# EasyEDA Pro project ProProject_ESP32-NOBREAK_2024-08-03.epro

# Schematic ESP32-NOBREAK
Create Date: 2024-07-30; Page Name: P1; Project Name: ESP32-NOBREAK; Schematic Name: ESP32-NOBREAK; Update Date: 2024-08-01
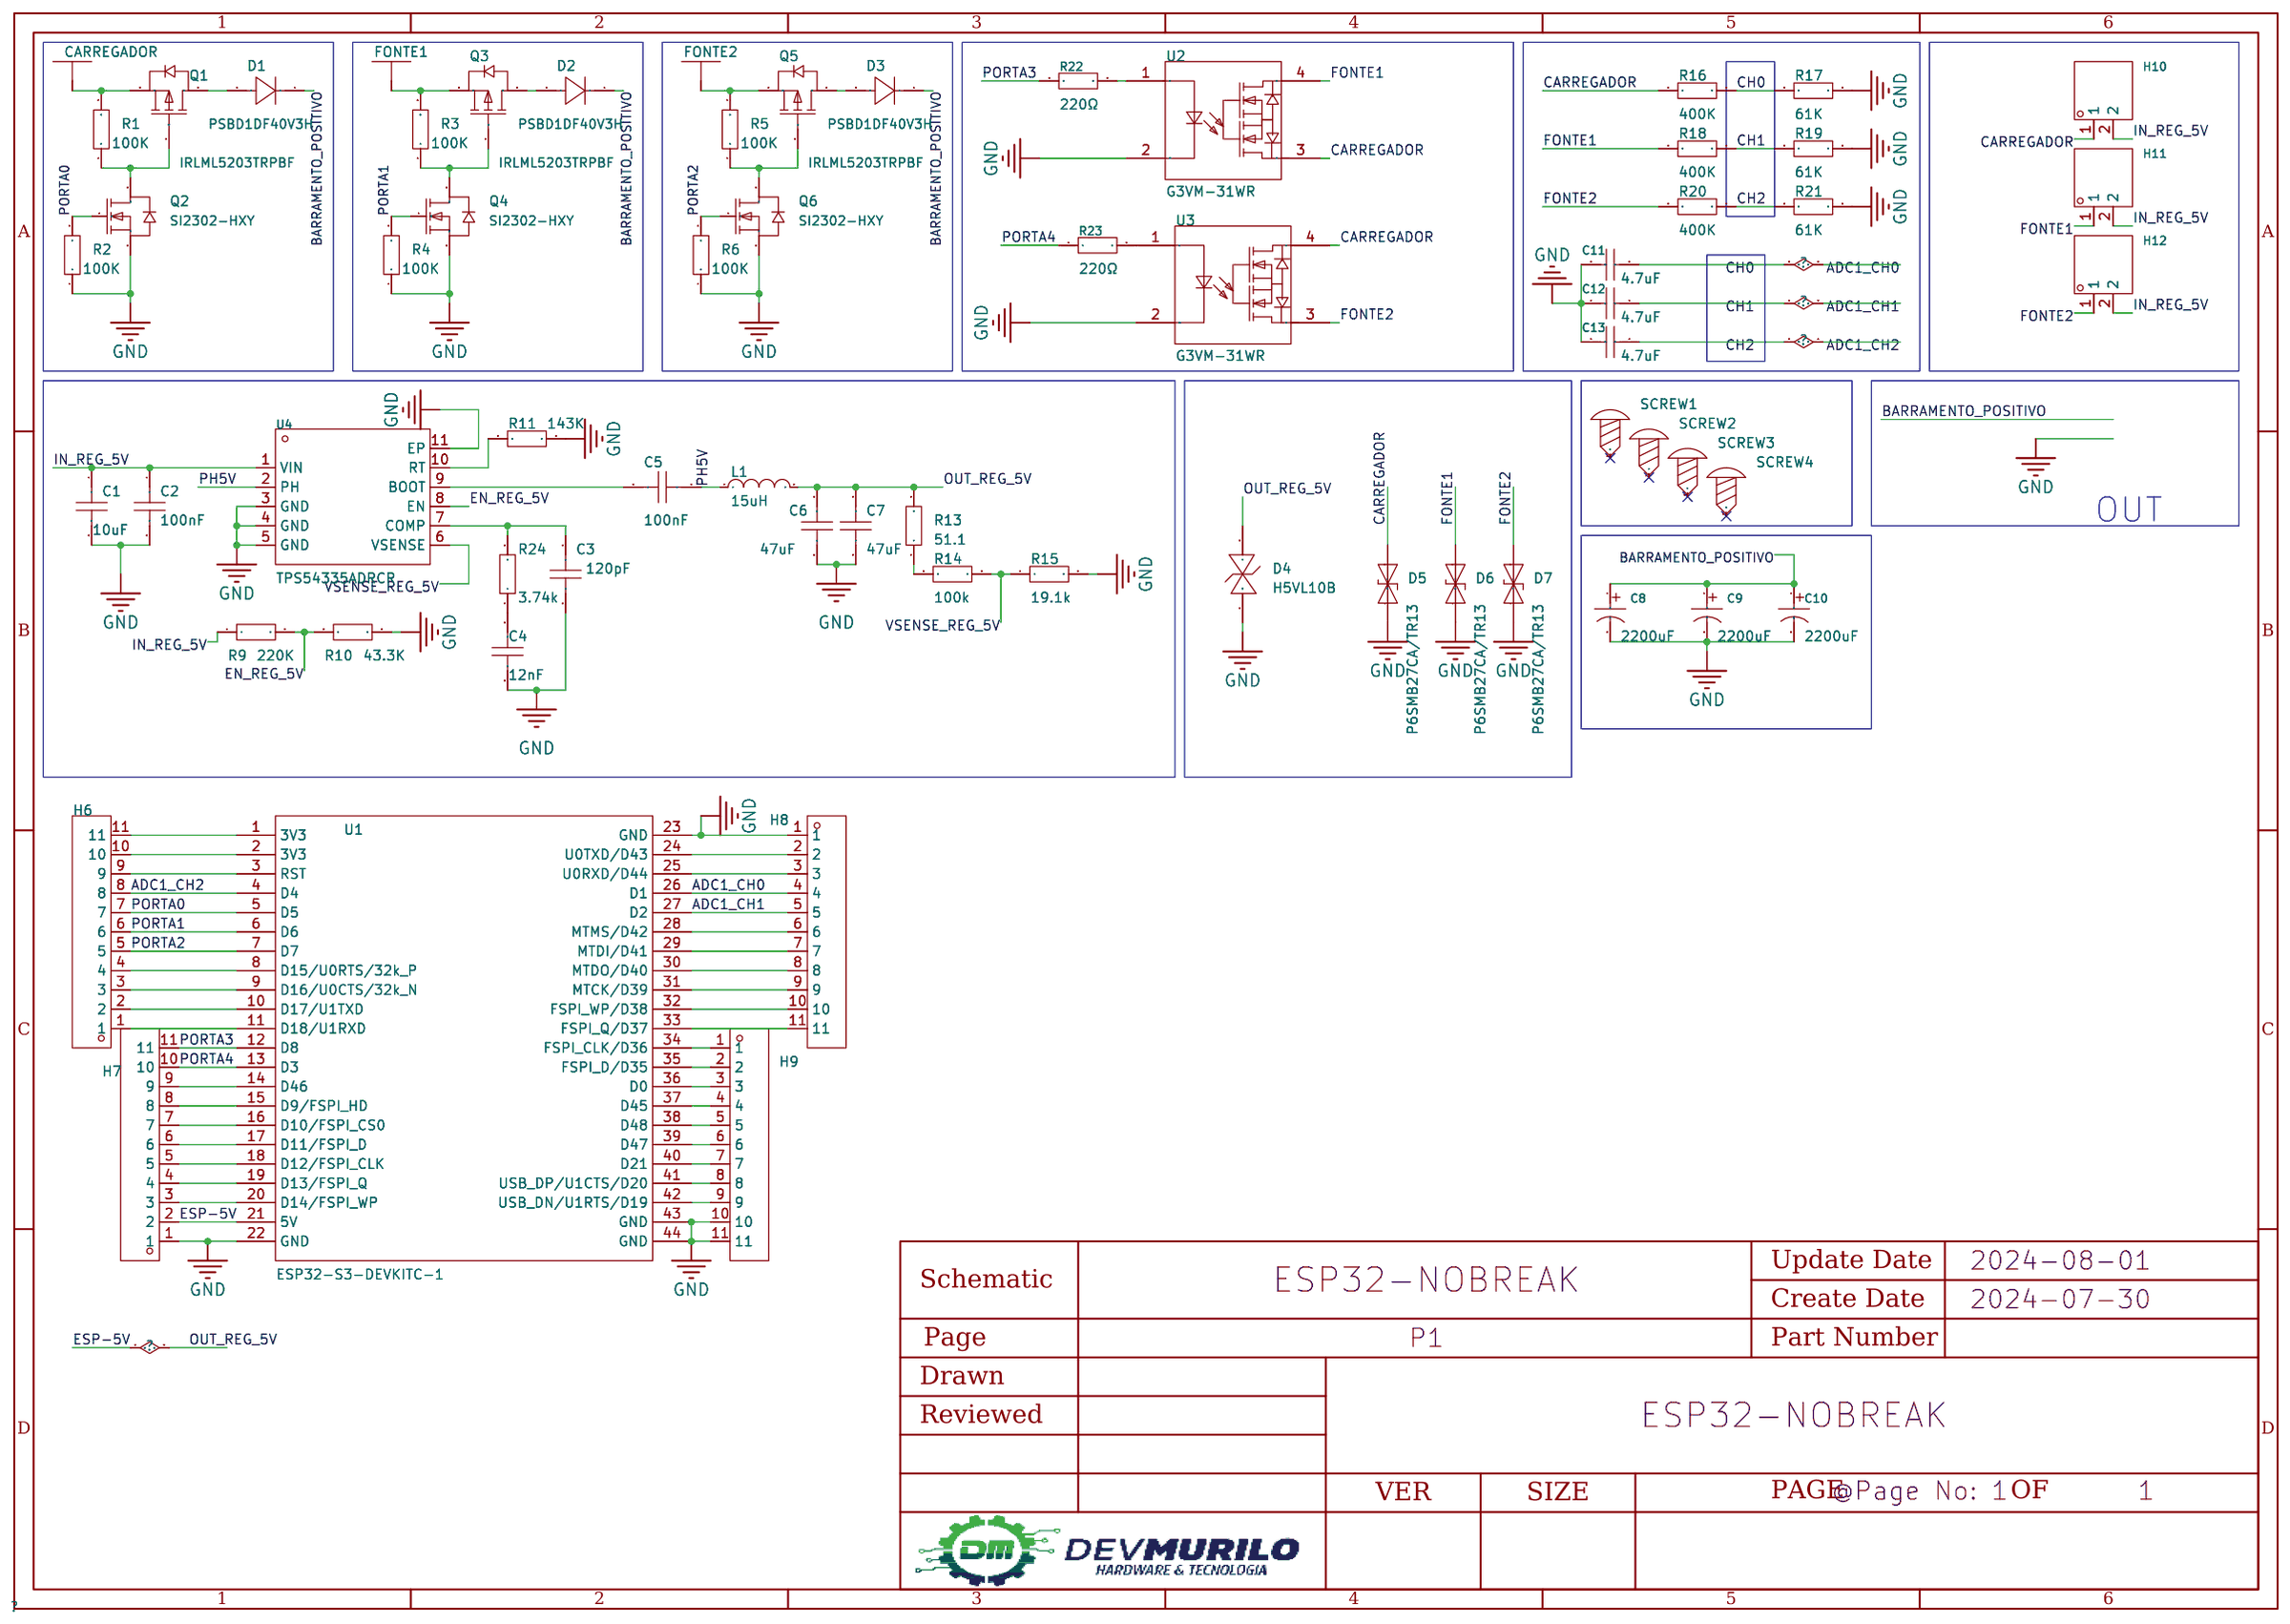
[diagram p0: schematic sheet]

## Parts
C1  10uF  [C0603]
C2  100nF  [C0603]
C3  120pF  [C0603]
C4  12nF  [C0603]
C5  100nF  [C0603]
C6  47uF  [C0603]
C7  47uF  [C0603]
C8  2200uF  [CAP-TH_BD13.0-P5.00-D0.6-FD]
C9  2200uF  [CAP-TH_BD13.0-P5.00-D0.6-FD]
C10  2200uF  [CAP-TH_BD13.0-P5.00-D0.6-FD]
C11  4.7uF  [C0603]
C12  4.7uF  [C0603]
C13  4.7uF  [C0603]
D1  PSBD1DF40V3H  [SOD-123FL_L2.8-W1.8-LS3.7-RD]
D2  PSBD1DF40V3H  [SOD-123FL_L2.8-W1.8-LS3.7-RD]
D3  PSBD1DF40V3H  [SOD-123FL_L2.8-W1.8-LS3.7-RD]
D4  H5VL10B  [SOD-882_L1.0-W0.6-BI]
D5  P6SMB27CA/TR13  [SMB_L4.3-W3.6-LS5.4-BI]
D6  P6SMB27CA/TR13  [SMB_L4.3-W3.6-LS5.4-BI]
D7  P6SMB27CA/TR13  [SMB_L4.3-W3.6-LS5.4-BI]
H6  -  [HDR-TH_11P-P2.54-V-M]
H7  -  [HDR-TH_11P-P2.54-V-M]
H8  -  [HDR-TH_11P-P2.54-V-M]
H9  -  [HDR-TH_11P-P2.54-V-M]
H10  -  [HDR-TH_2P-P2.54-V-M-1]
H11  -  [HDR-TH_2P-P2.54-V-M-1]
H12  -  [HDR-TH_2P-P2.54-V-M-1]
L1  15uH  [IND-SMD_L7.5-W6.6]
Q1  IRLML5203TRPBF  [SOT-23-3_L2.9-W1.3-P1.90-LS2.4-BR]
Q2  SI2302-HXY  [SOT-23-3_L2.9-W1.3-P1.90-LS2.4-BR]
Q3  IRLML5203TRPBF  [SOT-23-3_L2.9-W1.3-P1.90-LS2.4-BR]
Q4  SI2302-HXY  [SOT-23-3_L2.9-W1.3-P1.90-LS2.4-BR]
Q5  IRLML5203TRPBF  [SOT-23-3_L2.9-W1.3-P1.90-LS2.4-BR]
Q6  SI2302-HXY  [SOT-23-3_L2.9-W1.3-P1.90-LS2.4-BR]
R1  100K  [R0603]
R2  100K  [R0603]
R3  100K  [R0603]
R4  100K  [R0603]
R5  100K  [R0603]
R6  100K  [R0603]
R9  220K  [R0603]
R10  43.3K  [R0603]
R11  143K  [R0603]
R13  51.1  [R0603]
R14  100k  [R0603]
R15  19.1k  [R0603]
R16  400K  [R0603]
R17  61K  [R0603]
R18  400K  [R0603]
R19  61K  [R0603]
R20  400K  [R0603]
R21  61K  [R0603]
R22  220Ω  [R0603]
R23  220Ω  [R0603]
R24  3.74k  [R0603]
SCREW1  -  [Screw-Hole-M3]
SCREW2  -  [Screw-Hole-M3]
SCREW3  -  [Screw-Hole-M3]
SCREW4  -  [Screw-Hole-M3]
U1  ESP32-S3-DEVKITC-1  [ESP32-S3-DEVKITC-1]
U2  G3VM-31WR  [OPTO-SMD_OMRON_G3VM-31WR]
U3  G3VM-31WR  [OPTO-SMD_OMRON_G3VM-31WR]
U4  TPS54335ADRCR  [VSON-10_L3.0-W3.0-P0.50-TL-EP]

## Library data of the parts
C1-C7 = CAP_0603: Supplier Footprint: 0603
C8-C10 = GR228M035J25RR0VH4FP0: Capacitance:2200uF Tolerance:±20% Tolerance:±20% Rated Voltage: Ripple Current:- Equivalent Series Resistance(ESR):- Lead Spacing: φD: L: Lifetime @ Temp:- Operating Temperature:-40℃~+105℃ Operating Temperature:-40℃~+105℃; LCSC Part Name: 2200uF ±20% 35V; Supplier Part: C43275; Manufacturer: CX(承兴); Supplier Footprint: 插件,D13xL25mm; JLCPCB Part Class: Extended Part; Datasheet: https://atta.szlcsc.com/upload/public/pdf/source/20211027/ED0DA65C69F42D9BDEC91091BA4C03CD.pdf; Supplier: LCSC; Tolerance: ±20%; Operating Temperature: -40℃~+105℃
C11-C13 = CL10A475KP8NNNC: Capacitance: Tolerance:±10% Tolerance:±10% Voltage Rated: Temperature Coefficient:; LCSC Part Name: 4.7uF ±10% 10V; Supplier Part: C1705; Manufacturer: SAMSUNG(三星); Supplier Footprint: 0603; JLCPCB Part Class: Extended Part; Datasheet: https://atta.szlcsc.com/upload/public/pdf/source/20160218/1457707763339.pdf; Supplier: LCSC; Tolerance: ±10%
D1-D3 = PSBD1DF40V3H: Diode Configuration: Forward Voltage (Vf@If):550mV@1A Reverse Voltage (Vr): Average Rectified Current (Io): Power Dissipation:- Reverse Leakage Current:500uA@40V Reverse Recovery Time (trr):- Operating Temperature:-55℃~+150℃@(Tj) Operating Temperature:-55; LCSC Part Name: 电压:40V 电流:3A; Supplier Part: C918826; Manufacturer: Prisemi(芯导); Supplier Footprint: SOD-123FL; JLCPCB Part Class: Extended Part; Datasheet: https://atta.szlcsc.com/upload/public/pdf/source/20200316/C496545_D1644566B4C68CC5A9F3C2B76CEE5624.pdf; Supplier: LCSC; Forward Voltage (Vf@If): 550mV@1A; Reverse Leakage Current: 500uA@40V; Operating Temperature: -55℃~+150℃@(Tj)
D4 = H5VL10B: polarity:Bi-Directional Reverse Stand-Off Voltage (Vrwm):5V Maximum Clamping Voltage:10V Peak Pulse Current (Ipp)@10/1000us:5A Peak Pulse Power Dissipation (Ppp)@10/1000us:50W Breakdown Voltage:5.6V Reverse Leakage Current (Ir):100nA Number of Lines:单路 Op; Supplier Part: C7420372; Manufacturer: 宏迦橙; Supplier Footprint: DFN1006-2L; Datasheet: https://atta.szlcsc.com/upload/public/pdf/source/20230630/5024ECFEAD3C9801B07A8DBB967AB462.pdf; Supplier: LCSC; polarity: Bi-Directional; Reverse Stand-Off Voltage (Vrwm): 5V; Maximum Clamping Voltage: 10V; Peak Pulse Current (Ipp)@10/1000us: 5A; Peak Pulse Power Dissipation (Ppp)@10/1000us: 50W; Breakdown Voltage: 5.6V; Reverse Leakage Current (Ir): 100nA; Number of Lines: 单路; Operating Temperature: -55℃~+155℃; Type: TVS
D5-D7 = P6SMB27CA/TR13: polarity:Bi-Directional Reverse Stand-Off Voltage (Vrwm):23.1V Maximum Clamping Voltage:37.5V Peak Pulse Current (Ipp)@10/1000us:16.3A Peak Pulse Power Dissipation (Ppp)@10/1000us:600W Breakdown Voltage:25.7V Reverse Leakage Current (Ir):1uA Type:TVS; Supplier Part: C730015; Manufacturer: Brightking(君耀电子); Supplier Footprint: SMB(DO-214AA); Datasheet: https://atta.szlcsc.com/upload/public/pdf/source/20200427/C523079_59166269390C2E39D506F571DF3F73BD.pdf; Supplier: LCSC; polarity: Bi-Directional; Reverse Stand-Off Voltage (Vrwm): 23.1V; Maximum Clamping Voltage: 37.5V; Peak Pulse Current (Ipp)@10/1000us: 16.3A; Peak Pulse Power Dissipation (Ppp)@10/1000us: 600W; Breakdown Voltage: 25.7V; Reverse Leakage Current (Ir): 1uA; Type: TVS
H6-H9 = HDR-M_2.54_1x11P: Supplier Footprint: Through
H10-H12 = HDR-M_2.54_1x2P: Supplier Footprint: Through
L1 = CKST0605-15uH/M: Inductance: Tolerance:±20% Tolerance:±20% Rated Current: Saturation Current (Isat):4A DC Resistance (DCR):- Type:- Ratings:-; LCSC Part Name: 15uH ±20% 4A; Supplier Part: C3002651; Manufacturer: CENKER(岑科); Supplier Footprint: SMD,6.6x7.5mm; JLCPCB Part Class: Extended Part; Datasheet: https://atta.szlcsc.com/upload/public/pdf/source/20220713/D31DF092F41B22BC51FAADD502977C44.pdf; Supplier: LCSC; Tolerance: ±20%; Saturation Current (Isat): 4A
Q1 Q3 Q5 = IRLML5203TRPBF: Type:1个PChannel Drain Source Voltage (Vdss): Continuous Drain Current (Id): Power Dissipation (Pd): Drain Source On Resistance (RDS(on)@Vgs,Id):98mΩ@10V,3A Gate Threshold Voltage (Vgs(th)@Id):2.5V@250uA Total Gate Charge (Qg@Vgs):14nC@10V Input Capacitanc; LCSC Part Name: 1个P沟道 耐压:30V 电流:3A; Supplier Part: C2592; Manufacturer: Infineon(英飞凌); Supplier Footprint: SOT-23; JLCPCB Part Class: Extended Part; Datasheet: https://atta.szlcsc.com/upload/public/pdf/source/20200421/C513150_A0DAD0CB9056D25908B6C1BFCDF98824.pdf; Supplier: LCSC; Type: 1个PChannel; Drain Source On Resistance (RDS(on)@Vgs,Id): 98mΩ@10V,3A; Gate Threshold Voltage (Vgs(th)@Id): 2.5V@250uA; Total Gate Charge (Qg@Vgs): 14nC@10V; Input Capacitance (Ciss@Vds): 510pF@25V; Operating Temperature: -55℃~+150℃@(Tj)
Q2 Q4 Q6 = SI2302-HXY: Type:1个NChannel Drain Source Voltage (Vdss): Continuous Drain Current (Id): Power Dissipation (Pd):900mW Drain Source On Resistance (RDS(on)@Vgs,Id):55mΩ@4.5V,2.8A Gate Threshold Voltage (Vgs(th)@Id):1.2V@250uA Input Capacitance (Ciss@Vds):260pF@10V; LCSC Part Name: 1个N沟道 耐压:20V 电流:2.8A; Supplier Part: C4748714; Manufacturer: HXY MOSFET(华轩阳电子); Supplier Footprint: SOT-23; JLCPCB Part Class: Extended Part; Datasheet: https://atta.szlcsc.com/upload/public/pdf/source/20220720/B2EC63D46AD65363D9D3692163B46869.pdf; Supplier: LCSC; Type: 1个NChannel; Power Dissipation (Pd): 900mW; Drain Source On Resistance (RDS(on)@Vgs,Id): 55mΩ@4.5V,2.8A; Gate Threshold Voltage (Vgs(th)@Id): 1.2V@250uA; Input Capacitance (Ciss@Vds): 260pF@10V
R1-R6 R11 R13-R21 R24 = Res_0603: Supplier Footprint: 0603
R9 R10 = Res_0201: Supplier Footprint: 0201
R22 R23 = 0603WAF2200T5E: Type:Thick Film Resistors Resistance: Tolerance:±1% Tolerance:±1% Power(Watts): Overload Voltage (Max): Temperature Coefficient:±100ppm/℃ Temperature Coefficient:±100ppm/℃ Operating Temperature Range:-55℃~+155℃ Operating Temperature Range:-55℃~+155℃; LCSC Part Name: 220Ω ±1% 100mW 厚膜电阻; Supplier Part: C22962; Manufacturer: UNI-ROYAL(厚声); Supplier Footprint: 0603; JLCPCB Part Class: Basic Part; Datasheet: https://atta.szlcsc.com/upload/public/pdf/source/20200306/C422600_1E6D84923E4A46A82E41ADD87F860B5C.pdf; Supplier: LCSC; Type: Thick Film Resistors; Tolerance: ±1%; Temperature Coefficient: ±100ppm/℃; Operating Temperature Range: -55℃~+155℃
SCREW1-SCREW4 = Screw-Hole-M3: Supplier Footprint: 插件
U1 = ESP32-S3-DEVKITC-1: Manufacturer: Espressif; Manufacturer Part: ESP32-S3-DEVKITC-1U-N8R8; Supplier: DigiKey; Supplier Part: 1965-ESP32-S3-DEVKITC-1U-N8R8-ND; _: 3; Price: 99,23DKr
U2 U3 = G3VM-31WR: Supplier Part: C9900059545; Supplier Footprint: P-SON4; Supplier: LCSC
U4 = TPS54335ADRCR: Function:Step-down type Output Type:Adjustable Input Voltage:4.5V~28V Input Voltage:4.5V~28V Output Voltage:800mV~24V Output Voltage:800mV~24V Output Current (Max):3A Switching Frequency:1.5MHz Operating Temperature:-40℃~+150℃@(TJ) Operating Temperature:-; Supplier Part: C473400; Manufacturer: TI(德州仪器); Supplier Footprint: VSON-10-EP(3x3); JLCPCB Part Class: Extended Part; Datasheet: https://www.ti.com/cn/lit/gpn/tps54335a; Supplier: LCSC; Function: Step-down type; Output Type: Adjustable; Input Voltage: 4.5V~28V; Output Voltage: 800mV~24V; Output Current (Max): 3A; Switching Frequency: 1.5MHz; Operating Temperature: -40℃~+150℃@(TJ); Synchronous Rectification: Yes; Number of Outputs: 1; Topology: Step-down; Switch tube (built-in/external): 内置

## Nets
GND: C1.2 C2.2 C3.2 C4.2 C6.2 C7.2 C8.2 C9.2 C10.2 C11.1 C12.1 C13.1 D4.1(C) D5.1 D6.1 D7.1 H7.1 H8.1 H9.10 H9.11 Q2.2(S) Q4.2(S) Q6.2(S) R2.1 R4.1 R6.1 R10.2 R11.2 R15.2 R17.2 R19.2 R21.2 U1.22(GND) U1.23(GND) U1.43(GND) U1.44(GND) U2.2 U3.2 U4.3(GND) U4.4(GND) U4.5(GND) U4.11(EP)
ADC1_CH0: C11.2 H8.4 R16.2 R17.1 U1.26(D1)
ADC1_CH1: C12.2 H8.5 R18.2 R19.1 U1.27(D2)
ADC1_CH2: C13.2 H6.8 R20.2 R21.1 U1.4(D4)
BARRAMENTO_POSITIVO: C8.1 C9.1 C10.1 D1.1(K) D2.1(K) D3.1(K)
CARREGADOR: D5.2 H10.1 Q1.2(S) R1.2 R16.1 U2.3 U3.4
EN_REG_5V: R9.2 R10.1 U4.8(EN)
ESP-5V: C6.1 C7.1 D4.2(A) H7.2 L1.2 R13.2 U1.21(5V)
FONTE1: D6.2 H11.1 Q3.2(S) R3.2 R18.1 U2.4
FONTE2: D7.2 H12.1 Q5.2(S) R5.2 R20.1 U3.3
IN_REG_5V: C1.1 C2.1 H10.2 H11.2 H12.2 R9.1 U4.1(VIN)
PH5V: C5.1 L1.1 U4.2(PH)
PORTA0: H6.7 Q2.1(G) R2.2 U1.5(D5)
PORTA1: H6.6 Q4.1(G) R4.2 U1.6(D6)
PORTA2: H6.5 Q6.1(G) R6.2 U1.7(D7)
PORTA3: H7.11 R22.1 U1.12(D8)
PORTA4: H7.10 R23.1 U1.13(D3)
VSENSE_REG_5V: R14.2 R15.1 U4.6(VSENSE)
$1N629: D1.2(A) Q1.3(D)
$1N643: Q1.1(G) Q2.3(D) R1.1
$1N952: D2.2(A) Q3.3(D)
$1N954: Q3.1(G) Q4.3(D) R3.1
$1N1160: D3.2(A) Q5.3(D)
$1N1162: Q5.1(G) Q6.3(D) R5.1
$1N1257: R22.2 U2.1
$1N1849: R11.1 U4.10(RT)
$1N1919: C5.2 U4.9(BOOT)
$1N2046: C3.1 R24.2 U4.7(COMP)
$1N2413: R13.1 R14.1
$1N6328: R23.2 U3.1
$1N9020: H6.11 U1.1(3V3)
$1N9023: H6.10 U1.2(3V3)
$1N9026: H6.9 U1.3(RST)
$1N9087: H6.4 U1.8(D15/U0RTS/32k_P)
$1N9090: H6.3 U1.9(D16/U0CTS/32k_N)
$1N9093: H6.2 U1.10(D17/U1TXD)
$1N9096: H6.1 U1.11(D18/U1RXD)
$1N9099: H7.9 U1.14(D46)
$1N9102: H7.8 U1.15(D9/FSPI_HD)
$1N9105: H7.7 U1.16(D10/FSPI_CS0)
$1N9108: H7.6 U1.17(D11/FSPI_D)
$1N9111: H7.5 U1.18(D12/FSPI_CLK)
$1N9114: H7.4 U1.19(D13/FSPI_Q)
$1N9117: H7.3 U1.20(D14/FSPI_WP)
$1N9288: H8.2 U1.24(U0TXD/D43)
$1N9291: H8.3 U1.25(U0RXD/D44)
$1N9294: H8.6 U1.28(MTMS/D42)
$1N9307: H8.7 U1.29(MTDI/D41)
$1N9310: H8.8 U1.30(MTDO/D40)
$1N9313: H8.9 U1.31(MTCK/D39)
$1N9316: H8.10 U1.32(FSPI_WP/D38)
$1N9319: H8.11 U1.33(FSPI_Q/D37)
$1N9322: H9.1 U1.34(FSPI_CLK/D36)
$1N9325: H9.2 U1.35(FSPI_D/D35)
$1N9328: H9.3 U1.36(D0)
$1N9331: H9.4 U1.37(D45)
$1N9334: H9.5 U1.38(D48)
$1N9337: H9.6 U1.39(D47)
$1N9340: H9.7 U1.40(D21)
$1N9343: H9.8 U1.41(USB_DP/U1CTS/D20)
$1N9346: H9.9 U1.42(USB_DN/U1RTS/D19)
$1N9442: C4.1 R24.1

Not connected (* = marked no-connect by the designer): SCREW1 1*; SCREW2 1*; SCREW3 1*; SCREW4 1*

## Notes on the sheet
- OUT

# Board PCB1
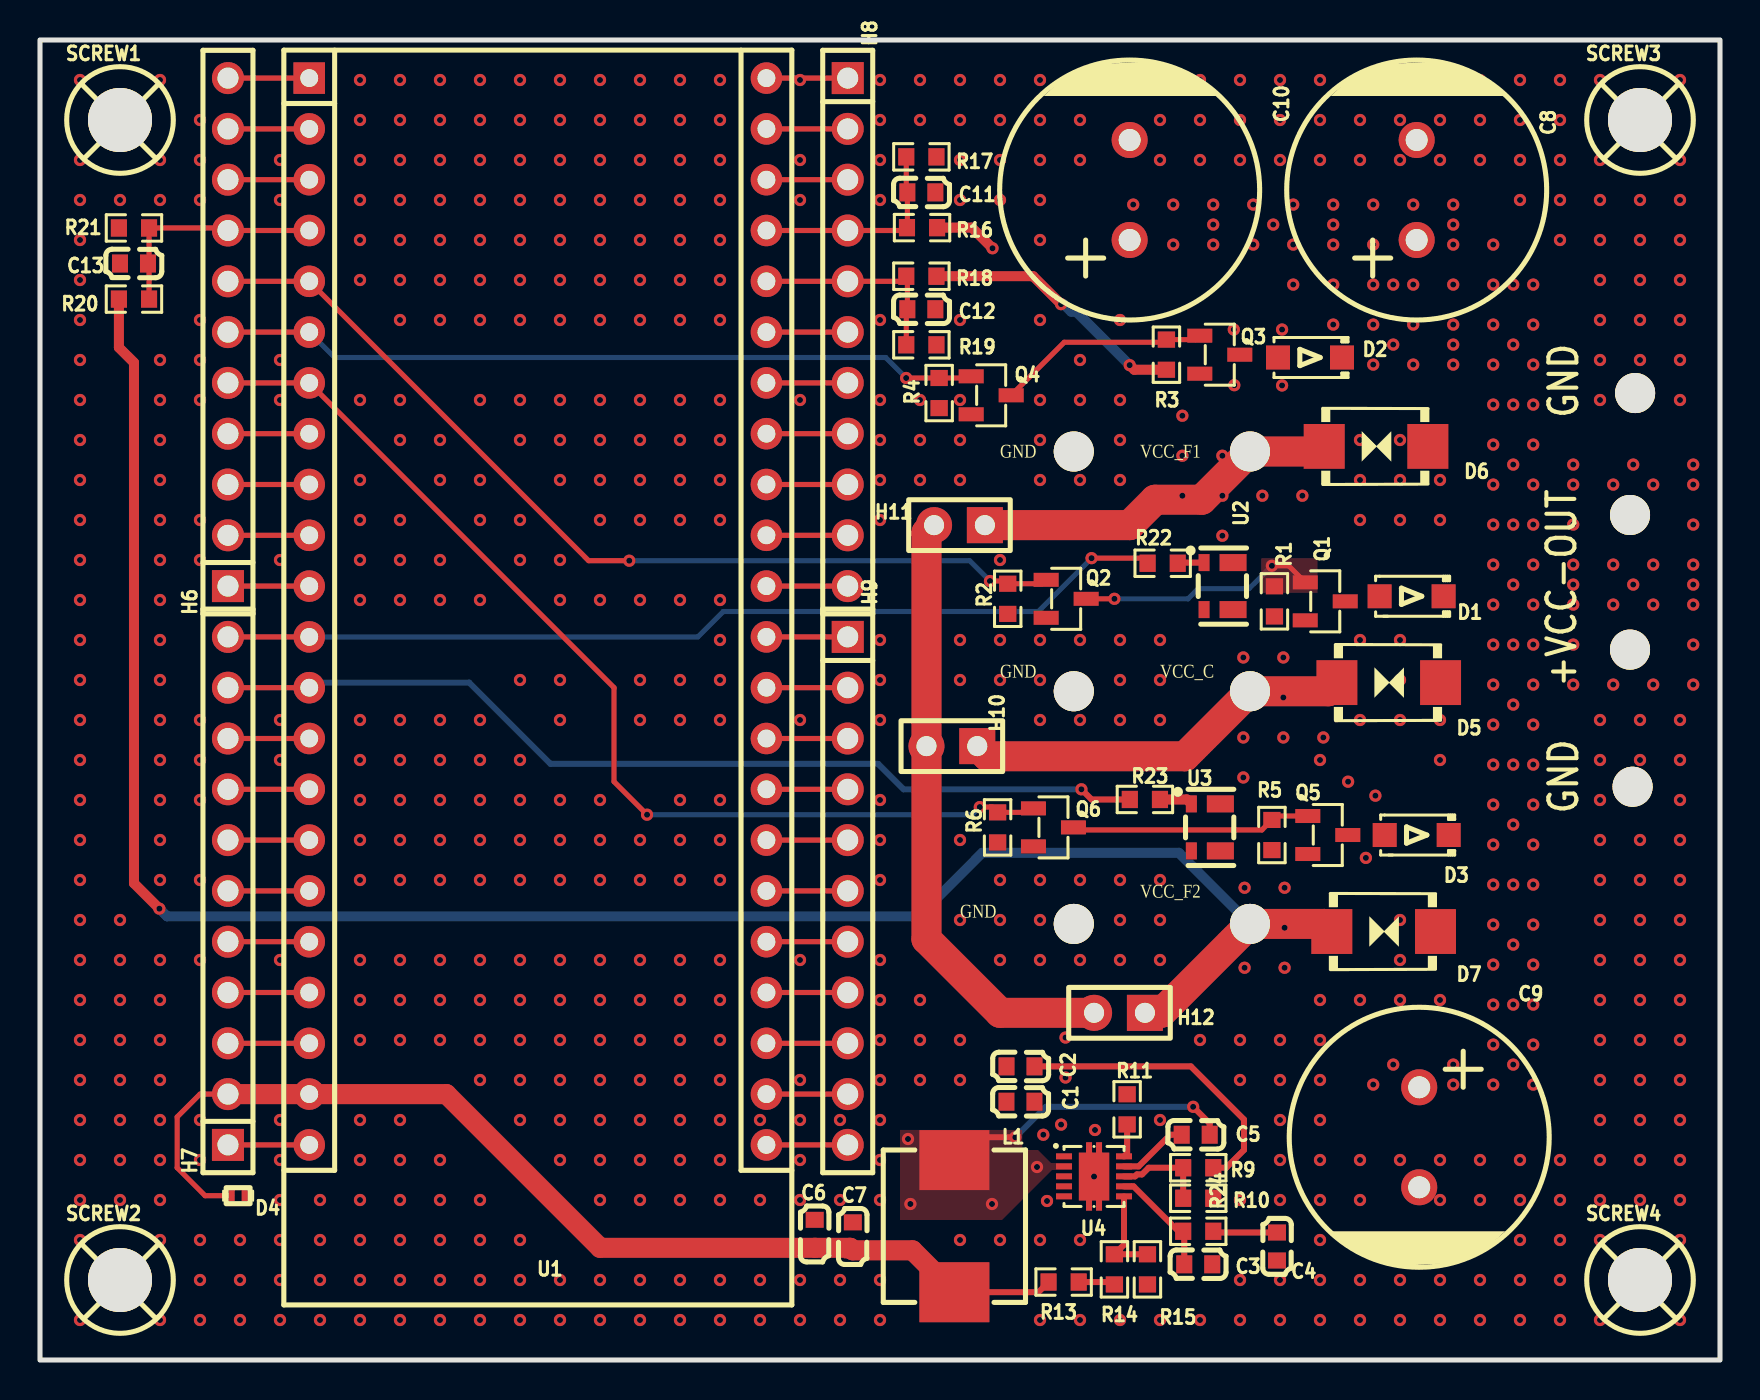
[diagram p1: board, top side]
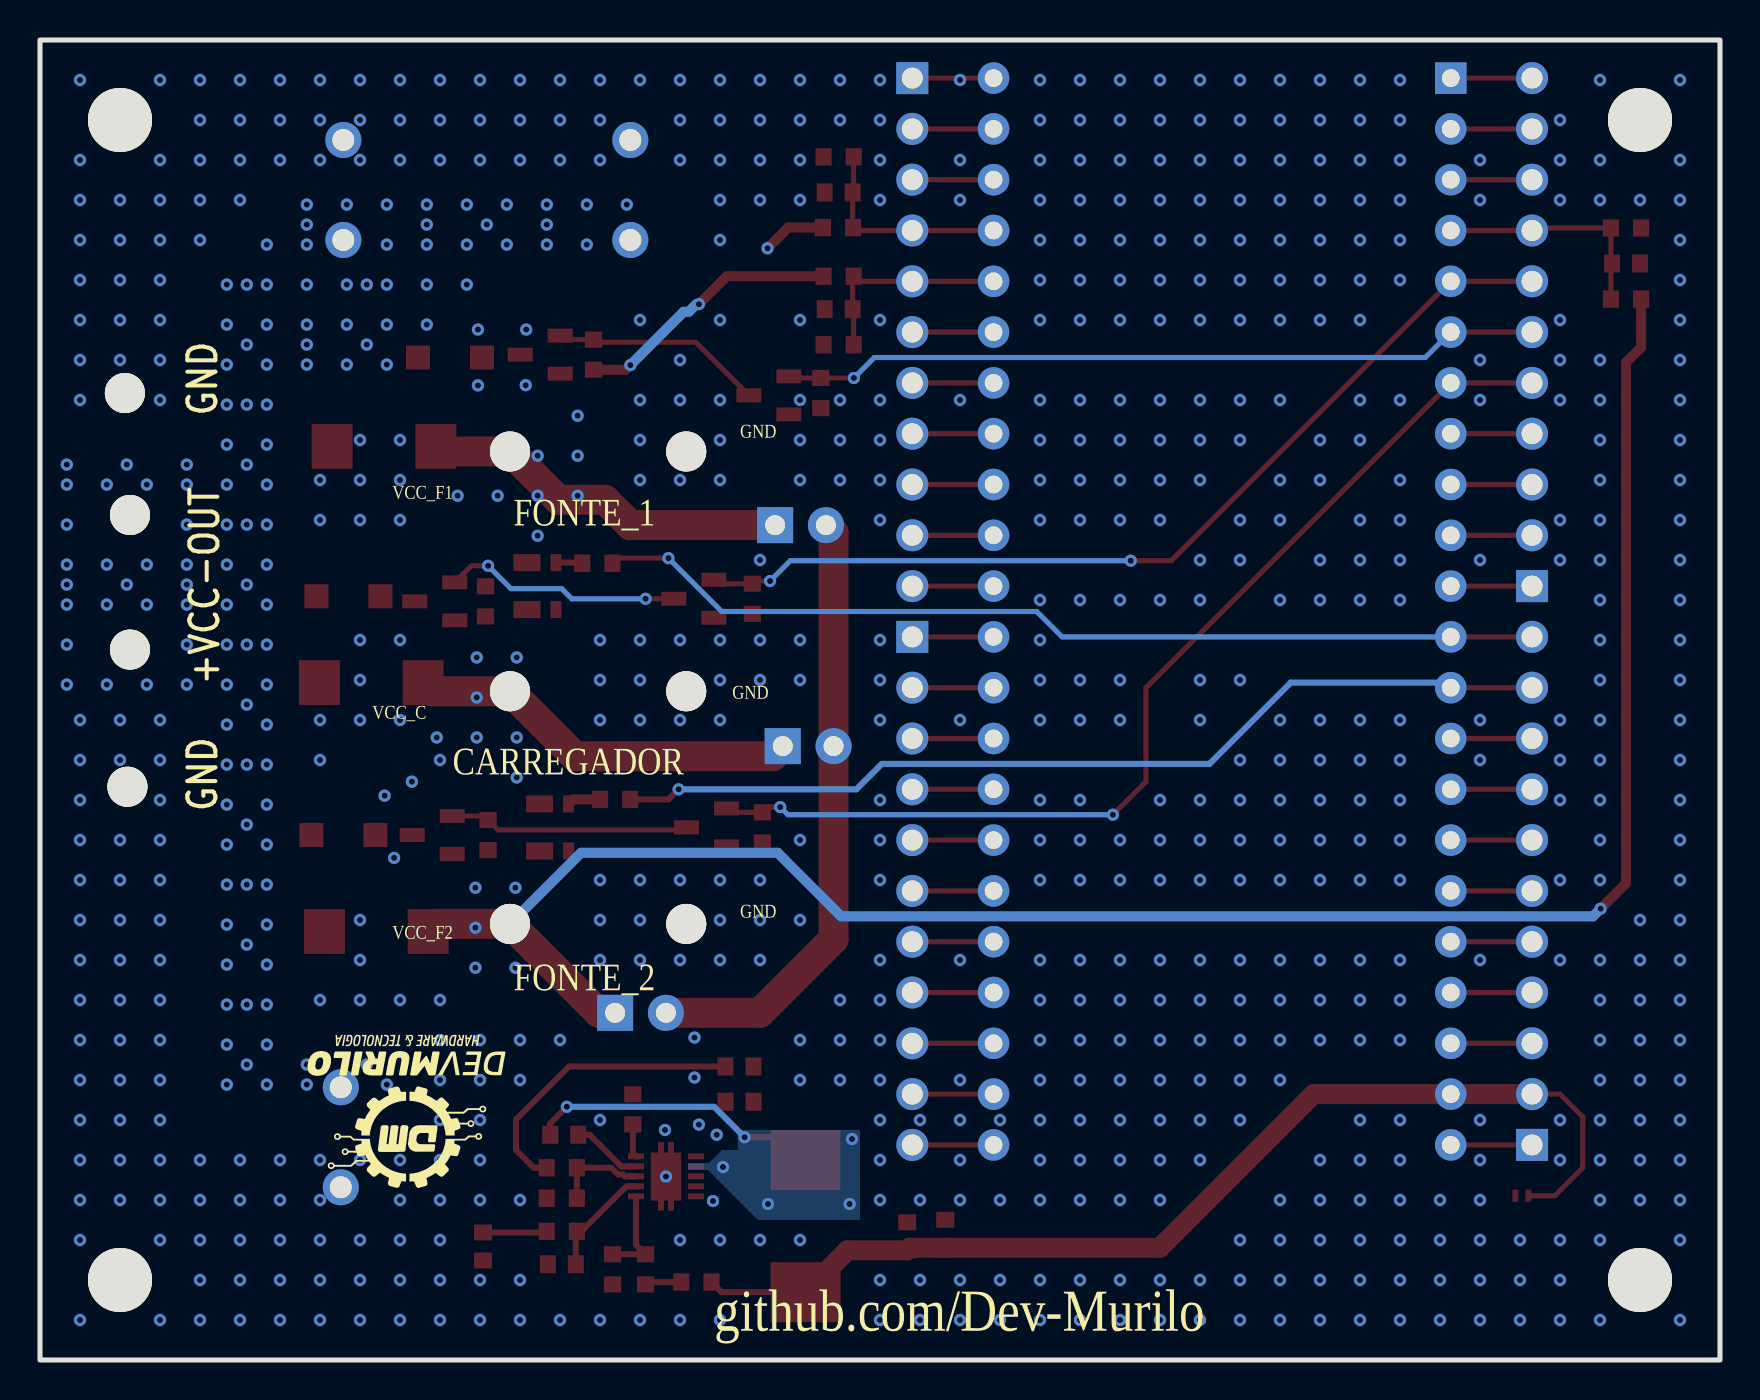
[diagram p2: board, bottom side, seen from below]

Outline 84 x 66 mm; copper layers: Top Layer, Inner1, Inner2, Bottom Layer. Coordinates in mm from the lower left corner of the outline.
Outline path: rectangle 0,66 84,0
Stack: Top Layer 0.035mm 外层铜厚1oz / Dielectric1 0.2104mm 7628 RC49% 8.6mil / Inner1 0.0152mm 内层铜厚 / Dielectric2 1.065mm 1.1mm H/HOZ 含铜 / Inner2 0.0152mm 内层铜厚 / Dielectric3 0.2104mm 7628 RC49% 8.6mil / Bottom Layer 0.035mm 外层铜厚1oz

## Design rules (mm)
template: Custom Config
spacing copperThickness1oz (default): track to track 0.102, other pairs 0.152 to 0.3
spacing copperThickness2oz: track to track 0.203, other pairs 0.152 to 0.3
spacing copperThicknessInner0.5oz: track to track 0.089, other pairs 0.152 to 0.3
track width copperThickness1oz (default): min 0.102, default 0.254, max 2.54
track width copperThickness2oz: min 0.203, default 0.254, max 2.54
track width copperThickness0.5oz: min 0.089, default 0.254, max 2.54
differential pair differentialPair (default): width min 0.127, default 0.254, max 2.54; gap min 0.152, default 0.152
via viaSize (default): diameter min 0.3, default 0.61, max 10; hole min 0.2, default 0.305, max 6.3
net  uses cooperSolidRegion
net GND uses cooperSolidRegion
net CARREGADOR uses cooperSolidRegion
net $1N629 uses cooperSolidRegion
net FONTE1 uses cooperSolidRegion
net FONTE2 uses cooperSolidRegion
net $1N1160 uses cooperSolidRegion
net IN_REG_5V uses cooperSolidRegion
net PH5V uses cooperSolidRegion
pour e474 uses cooperSolidRegion

## Placement (name value [footprint] x y rotation side)
C1  10uF  [C0603]  49.02 12.91 180 top
C2  100nF  [C0603]  49.03 14.68 180 top
C3  120pF  [C0603]  57.91 4.79 0 top
C4  12nF  [C0603]  61.85 5.68 270 top
C5  100nF  [C0603]  57.78 11.26 180 top
C6  47uF  [C0603]  38.74 6.31 90 top
C7  47uF  [C0603]  40.64 6.18 90 top
C8  2200uF  [cap-th_bd13.0-p5.00-d0.6-fd]  68.83 58.5 90 top
C9  2200uF  [cap-th_bd13.0-p5.00-d0.6-fd]  68.96 11.14 270 top
C10  2200uF  [cap-th_bd13.0-p5.00-d0.6-fd]  54.48 58.5 90 top
C11  4.7uF  [C0603]  44.07 58.38 180 top
C12  4.7uF  [C0603]  44.07 52.54 180 top
C13  4.7uF  [C0603]  4.7 54.82 0 top
D1  PSBD1DF40V3H  [sod-123fl_l2.8-w1.8-ls3.7-rd]  68.58 38.19 180 top
D2  PSBD1DF40V3H  [sod-123fl_l2.8-w1.8-ls3.7-rd]  63.5 50.12 180 top
D3  PSBD1DF40V3H  [sod-123fl_l2.8-w1.8-ls3.7-rd]  68.83 26.25 180 top
D4  H5VL10B  [SOD-882_L1.0-W0.6-BI]  9.91 8.22 180 top
D5  P6SMB27CA/TR13  [SMB_L4.3-W3.6-LS5.4-BI]  67.44 33.87 180 top
D6  P6SMB27CA/TR13  [SMB_L4.3-W3.6-LS5.4-BI]  66.8 45.68 180 top
D7  P6SMB27CA/TR13  [SMB_L4.3-W3.6-LS5.4-BI]  67.18 21.42 180 top
H6  -  [HDR-TH_11P-P2.54-V-M]  9.4 51.39 90 top
H7  -  [HDR-TH_11P-P2.54-V-M]  9.4 23.45 90 top
H8  -  [HDR-TH_11P-P2.54-V-M]  40.39 51.39 270 top
H9  -  [HDR-TH_11P-P2.54-V-M]  40.39 23.45 270 top
H10  -  [HDR-TH_2P-P2.54-V-M-1]  45.59 30.69 180 top
H11  -  [HDR-TH_2P-P2.54-V-M-1]  45.97 41.74 180 top
H12  -  [HDR-TH_2P-P2.54-V-M-1]  53.97 17.36 180 top
L1  15uH  [IND-SMD_L7.5-W6.6]  45.72 6.69 270 top
NOREF  -  [Pad_e78]  60.5 33.44 0 top
NOREF#2  -  [Pad_e80]  60.5 21.8 0 top
NOREF#3  -  [Pad_e79]  51.69 21.8 0 top
NOREF#4  -  [Pad_e88]  79.63 28.66 270 top
NOREF#5  -  [Pad_e87]  79.5 35.52 270 top
NOREF#6  -  [Pad_e74]  60.5 45.43 0 top
NOREF#7  -  [Pad_e86]  79.76 48.35 90 top
NOREF#8  -  [Pad_e85]  79.5 42.25 90 top
NOREF#9  -  [Pad_e77]  51.69 33.44 0 top
NOREF#10  -  [Pad_e76]  51.69 45.43 0 top
Q1  IRLML5203TRPBF  [SOT-23-3_L2.9-W1.3-P1.90-LS2.4-BR]  64.26 37.93 180 top
Q2  SI2302-HXY  [SOT-23-3_L2.9-W1.3-P1.90-LS2.4-BR]  51.31 38.06 180 top
Q3  IRLML5203TRPBF  [SOT-23-3_L2.9-W1.3-P1.90-LS2.4-BR]  58.99 50.27 180 top
Q4  SI2302-HXY  [SOT-23-3_L2.9-W1.3-P1.90-LS2.4-BR]  47.56 48.23 180 top
Q5  IRLML5203TRPBF  [SOT-23-3_L2.9-W1.3-P1.90-LS2.4-BR]  64.39 26.25 180 top
Q6  SI2302-HXY  [SOT-23-3_L2.9-W1.3-P1.90-LS2.4-BR]  50.67 26.63 180 top
R1  100K  [R0603]  61.72 37.93 270 top
R2  100K  [R0603]  48.39 38.06 90 top
R3  100K  [R0603]  56.32 50.27 270 top
R4  100K  [R0603]  44.96 48.35 90 top
R5  100K  [R0603]  61.59 26.25 270 top
R6  100K  [R0603]  47.88 26.63 90 top
R9  220K  [R0603]  57.91 9.61 180 top
R10  43.3K  [R0603]  57.91 8.09 0 top
R11  143K  [R0603]  54.36 12.53 90 top
R13  51.1  [R0603]  51.18 3.9 180 top
R14  100k  [R0603]  53.72 4.53 90 top
R15  19.1k  [R0603]  55.37 4.53 270 top
R16  400K  [R0603]  44.1 56.62 180 top
R17  61K  [R0603]  44.07 60.16 0 top
R18  400K  [R0603]  44.07 54.19 180 top
R19  61K  [R0603]  44.07 50.76 0 top
R20  400K  [R0603]  4.7 53.05 0 top
R21  61K  [R0603]  4.7 56.6 180 top
R22  220Ω  [R0603]  56.13 39.84 0 top
R23  220Ω  [R0603]  55.25 28.03 0 top
R24  3.74k  [R0603]  57.91 6.44 180 top
SCREW1  -  [Screw-Hole-M3]  4.06 61.94 0 top
SCREW2  -  [Screw-Hole-M3]  4.06 3.94 0 top
SCREW3  -  [Screw-Hole-M3]  80.06 61.94 0 top
SCREW4  -  [screw-hole-m3]  80.06 3.94 0 top
U1  -  [ESP32-S3-DEVKITC-1]  24.89 33.61 0 top
U2  G3VM-31WR  [OPTO-SMD_OMRON_G3VM-31WR]  58.93 38.69 270 top
U3  G3VM-31WR  [OPTO-SMD_OMRON_G3VM-31WR]  58.29 26.63 270 top
U4  TPS54335ADRCR  [VSON-10_L3.0-W3.0-P0.50-TL-EP]  52.7 9.18 0 top

## Footprints (pads in the part's own frame, mm; a bottom-side part is the same pattern mirrored in y, then rotated)
C0603
  rect 0.8x0.9 smd: 1(-0.7,0) 2(0.7,0)
cap-th_bd13.0-p5.00-d0.6-fd
  round 1.8 hole 1.1: 1(-2.5,0) 2(2.5,0)
ESP32-S3-DEVKITC-1
  rect 1.575x1.575 hole 0.889: 1(-11.43,30.48)
  round 1.575 hole 0.889: 2(-11.43,27.94) 3(-11.43,25.4) 4(-11.43,22.86) 5(-11.43,20.32) 6(-11.43,17.78) 7(-11.43,15.24) 8(-11.43,12.7) 9(-11.43,10.16) 10(-11.43,7.62) 11(-11.43,5.08) 12(-11.43,2.54) 13(-11.43,0) 14(-11.43,-2.54) 15(-11.43,-5.08) 16(-11.43,-7.62) 17(-11.43,-10.16) 18(-11.43,-12.7) 19(-11.43,-15.24) 20(-11.43,-17.78) 21(-11.43,-20.32) 22(-11.43,-22.86) 23(11.43,30.48) 24(11.43,27.94) 25(11.43,25.4) 26(11.43,22.86) 27(11.43,20.32) 28(11.43,17.78) 29(11.43,15.24) 30(11.43,12.7) 31(11.43,10.16) 32(11.43,7.62) 33(11.43,5.08) 34(11.43,2.54) 35(11.43,0) 36(11.43,-2.54) 37(11.43,-5.08) 38(11.43,-7.62) 39(11.43,-10.16) 40(11.43,-12.7) 41(11.43,-15.24) 42(11.43,-17.78) 43(11.43,-20.32) 44(11.43,-22.86)
HDR-TH_2P-P2.54-V-M-1
  rect 1.8x1.8 hole 1: 1(-1.27,0)
  round 1.8 hole 1: 2(1.27,0)
HDR-TH_11P-P2.54-V-M
  rect 1.6x1.6 hole 1.05: 1(-12.7,0)
  round 1.6 hole 1.05: 2(-10.16,0) 3(-7.62,0) 4(-5.08,0) 5(-2.54,0) 6(0,0) 7(2.54,0) 8(5.08,0) 9(7.62,0) 10(10.16,0) 11(12.7,0)
IND-SMD_L7.5-W6.6
  rect 3x3.5 smd: 1(-3.302,0) 2(3.302,0)
OPTO-SMD_OMRON_G3VM-31WR
  rect 0.85x0.55 smd: 1(-1.175,-0.725) 2(1.175,-0.725)
  rect 0.85x1.35 smd: 3(1.175,0.725) 4(-1.175,0.725)
Pad_e74
  round 2 hole 2: 1(0,0)
Pad_e76
  round 2 hole 2: 1(0,0)
Pad_e77
  round 2 hole 2: 1(0,0)
Pad_e78
  round 2 hole 2: 1(0,0)
Pad_e79
  round 2 hole 2: 1(0,0)
Pad_e80
  round 2 hole 2: 1(0,0)
Pad_e85
  round 2 hole 2: 1(0,0)
Pad_e86
  round 2 hole 2: 1(0,0)
Pad_e87
  round 2 hole 2: 1(0,0)
Pad_e88
  round 2 hole 2: 1(0,0)
R0603
  rect 0.806x0.864 smd: 1(-0.753,0) 2(0.753,0)
Screw-Hole-M3
  round 3.2 hole 3.2: 1(-0.064,0.064)
screw-hole-m3
  round 3.2 hole 3.2: 1(-0.064,0.064)
SMB_L4.3-W3.6-LS5.4-BI
  rect 2.047x2.241 smd: 1(-2.591,0) 2(2.591,0)
sod-123fl_l2.8-w1.8-ls3.7-rd
  rect 1.2x1.2 smd: 1(-1.6,0) 2(1.6,0)
SOD-882_L1.0-W0.6-BI
  rect 0.3x0.6 smd: 1(-0.325,0) 2(0.325,0)
SOT-23-3_L2.9-W1.3-P1.90-LS2.4-BR
  rect 1.25x0.7 smd: 1(1,-0.95) 2(1,0.95) 3(-1,0)
VSON-10_L3.0-W3.0-P0.50-TL-EP
  rect 0.8x0.3 smd: 1(-1.5,1) 2(-1.5,0.5) 3(-1.5,0) 4(-1.5,-0.5) 5(-1.5,-1) 6(1.5,-1) 7(1.5,-0.5) 8(1.5,0) 9(1.5,0.5) 10(1.5,1)
  custom 1.52x3.42 smd: 11(0.002,-0.009)

## Nets
As in the schematic, except:
GND: C1.2 C2.2 C3.2 C4.2 C6.2 C7.2 C8.2 C9.2 C10.2 C11.1 C12.1 C13.1 D4.1 D5.1 D6.1 D7.1 H7.1 H8.1 H9.10 H9.11 NOREF#3.1 NOREF#4.1 NOREF#7.1 NOREF#9.1 NOREF#10.1 Q2.2 Q4.2 Q6.2 R2.1 R4.1 R6.1 R10.2 R11.2 R15.2 R17.2 R19.2 R21.2 U1.22 U1.23 U1.43 U1.44 U2.2 U3.2 U4.3 U4.4 U4.5 U4.11
BARRAMENTO_POSITIVO: C8.1 C9.1 C10.1 D1.1 D2.1 D3.1 NOREF#5.1 NOREF#8.1
CARREGADOR: D5.2 H10.1 NOREF.1 Q1.2 R1.2 R16.1 U2.3 U3.4
FONTE1: D6.2 H11.1 NOREF#6.1 Q3.2 R3.2 R18.1 U2.4
FONTE2: D7.2 H12.1 NOREF#2.1 Q5.2 R5.2 R20.1 U3.3

Pads without a net: SCREW1 1; SCREW2 1; SCREW3 1; SCREW4 1

## Via types
v1: diameter 0.61, hole 0.305, Top Layer to Bottom Layer, 26 vias
v2: diameter 0.61, hole 0.304, Top Layer to Bottom Layer, 802 vias

## Routing (per net, layer and track width the routed paths; a pad name or vN(x,y) marks a point on that pad's centre or on a via; arc(x,y) is an arc through that point)
GND: length 16.3
  Top Layer w0.254: H9.11 U1.44 ; H7.1 U1.22 ; U1.23 H8.1 ; 36.32,13.3 H9.10
  vias: v1(50.35,7.95) v1(52.7,9.17) v1(52.75,11.5) v2(2,64) v2(2,60) v2(2,58) v2(2,56) v2(2,54) v2(2,52) v2(2,50) v2(2,48) v2(2,46) v2(2,44) v2(2,42) v2(2,40) v2(2,38) v2(2,36) v2(2,34) v2(2,32) v2(2,30) v2(2,28) v2(2,26) v2(2,24) v2(2,22) v2(2,20) v2(2,18) v2(2,16) v2(2,14) v2(2,12) v2(2,10) v2(2,8) v2(2,6) v2(2,2) v2(4,58) v2(4,22) v2(4,20) v2(4,18) v2(4,16) v2(4,14) v2(4,12) v2(4,10) v2(4,8) v2(6,64) v2(6,60) v2(6,58) v2(6,50) v2(6,48) v2(6,46) v2(6,44) v2(6,42) v2(6,40) v2(6,38) v2(6,36) v2(6,34) v2(6,32) v2(6,30) v2(6,28) v2(6,26) v2(6,24) v2(6,20) v2(6,18) v2(6,16) v2(6,14) v2(6,12) v2(6,10) v2(6,8) v2(6,6) v2(6,2) v2(8,62) v2(8,60) v2(8,58) v2(8,52) v2(8,50) v2(8,48) v2(8,42) v2(8,40) v2(8,32) v2(8,30) v2(8,28) v2(8,24) v2(8,20) v2(8,12) v2(8,10) v2(8,6) v2(8,4) v2(8,2) v2(10,6) v2(10,4) v2(10,2) v2(12,60) v2(12,58) v2(12,50) v2(12,48) v2(12,40) v2(12,32) v2(12,30) v2(12,20) v2(12,12) v2(12,10) v2(12,8) v2(12,6) v2(12,4) v2(12,2) v2(14,8) v2(14,6) v2(14,4) v2(14,2) v2(16,64) v2(16,62) v2(16,60) v2(16,58) v2(16,56) v2(16,54) v2(16,48) v2(16,44) v2(16,42) v2(16,40) v2(16,38) v2(16,32) v2(16,30) v2(16,28) v2(16,26) v2(16,24) v2(16,20) v2(16,18) v2(16,16) v2(16,12) v2(16,10) v2(16,8) v2(16,6) v2(16,4) v2(16,2) v2(18,64) v2(18,62) v2(18,60) v2(18,58) v2(18,56) v2(18,54) v2(18,52) v2(18,48) v2(18,46) v2(18,42) v2(18,40) v2(18,38) v2(18,32) v2(18,30) v2(18,28) v2(18,26) v2(18,24) v2(18,20) v2(18,18) v2(18,16) v2(18,12) v2(18,10) v2(18,8) v2(18,6) v2(18,4) v2(18,2) v2(20,64) v2(20,62) v2(20,60) v2(20,58) v2(20,56) v2(20,54) v2(20,52) v2(20,46) v2(20,44) v2(20,40) v2(20,38) v2(20,32) v2(20,30) v2(20,28) v2(20,26) v2(20,24) v2(20,20) v2(20,18) v2(20,16) v2(20,10) v2(20,8) v2(20,6) v2(20,4) v2(20,2) v2(22,64) v2(22,62) v2(22,60) v2(22,58) v2(22,56) v2(22,54) v2(22,52) v2(22,48) v2(22,44) v2(22,42) v2(22,38) v2(22,32) v2(22,30) v2(22,28) v2(22,26) v2(22,24) v2(22,20) v2(22,18) v2(22,16) v2(22,14) v2(22,8) v2(22,6) v2(22,4) v2(22,2) v2(24,64) v2(24,62) v2(24,60) v2(24,58) v2(24,56) v2(24,54) v2(24,52) v2(24,48) v2(24,46) v2(24,42) v2(24,40) v2(24,34) v2(24,30) v2(24,28) v2(24,26) v2(24,24) v2(24,20) v2(24,18) v2(24,16) v2(24,14) v2(24,12) v2(24,6) v2(24,4) v2(24,2) v2(26,64) v2(26,62) v2(26,60) v2(26,58) v2(26,56) v2(26,54) v2(26,52) v2(26,48) v2(26,46) v2(26,44) v2(26,40) v2(26,38) v2(26,34) v2(26,32) v2(26,28) v2(26,26) v2(26,24) v2(26,20) v2(26,18) v2(26,16) v2(26,14) v2(26,12) v2(26,10) v2(26,4) v2(26,2) v2(28,64) v2(28,62) v2(28,60) v2(28,58) v2(28,56) v2(28,54) v2(28,52) v2(28,48) v2(28,46) v2(28,44) v2(28,42) v2(28,38) v2(28,28) v2(28,26) v2(28,24) v2(28,20) v2(28,18) v2(28,16) v2(28,14) v2(28,12) v2(28,10) v2(28,8) v2(28,4) v2(28,2) v2(30,64) v2(30,62) v2(30,60) v2(30,58) v2(30,56) v2(30,54) v2(30,52) v2(30,48) v2(30,46) v2(30,44) v2(30,42) v2(30,38) v2(30,34) v2(30,32) v2(30,26) v2(30,24) v2(30,20) v2(30,18) v2(30,16) v2(30,14) v2(30,12) v2(30,10) v2(30,8) v2(30,4) v2(30,2) v2(32,64) v2(32,62) v2(32,60) v2(32,58) v2(32,56) v2(32,54) v2(32,52) v2(32,48) v2(32,46) v2(32,44) v2(32,42) v2(32,38) v2(32,34) v2(32,32) v2(32,28) v2(32,26) v2(32,24) v2(32,20) v2(32,18) v2(32,16) v2(32,14) v2(32,12) v2(32,10) v2(32,8) v2(32,4) v2(32,2) v2(34,64) v2(34,62) v2(34,60) v2(34,58) v2(34,56) v2(34,54) v2(34,52) v2(34,48) v2(34,46) v2(34,44) v2(34,42) v2(34,38) v2(34,36) v2(34,34) v2(34,32) v2(34,28) v2(34,26) v2(34,24) v2(34,20) v2(34,18) v2(34,16) v2(34,14) v2(34,12) v2(34,10) v2(34,8) v2(34,4) v2(34,2) v2(36,12) v2(36,8) v2(36,4) v2(36,2) v2(38,64) v2(38,60) v2(38,58) v2(38,48) v2(38,32) v2(38,20) v2(38,14) v2(38,12) v2(38,10) v2(38,8) v2(38,4) v2(38,2) v2(40,12) v2(40,8) v2(40,4) v2(40,2) v2(42,64) v2(42,62) v2(42,60) v2(42,58) v2(42,52) v2(42,48) v2(42,46) v2(42,44) v2(42,42) v2(42,36) v2(42,34) v2(42,32) v2(42,28) v2(42,26) v2(42,24) v2(42,20) v2(42,18) v2(42,16) v2(42,14) v2(42,12) v2(42,10) v2(42,8) v2(42,4) v2(42,2) v2(44,64) v2(44,62) v2(44,48) v2(44,46) v2(44,44) v2(44,18) v2(44,16) v2(44,14) v2(46,64) v2(46,62) v2(46,60) v2(46,58) v2(46,52) v2(46,48) v2(46,46) v2(46,44) v2(46,36) v2(46,34) v2(46,26) v2(46,22) v2(46,16) v2(46,14) v2(46,6) v2(48,64) v2(48,62) v2(48,60) v2(48,58) v2(48,40) v2(48,36) v2(48,34) v2(48,24) v2(48,22) v2(48,20) v2(48,6) v2(50,64) v2(50,62) v2(50,60) v2(50,58) v2(50,56) v2(50,52) v2(50,48) v2(50,46) v2(50,44) v2(50,36) v2(50,34) v2(50,32) v2(50,24) v2(50,22) v2(50,20) v2(50,6) v2(50,2) v2(52,64) v2(52,62) v2(52,60) v2(52,50) v2(52,48) v2(52,44) v2(52,36) v2(52,32) v2(52,24) v2(52,20) v2(52,6) v2(52,2) v2(54,64) v2(54,52) v2(54,48) v2(54,46) v2(54,44) v2(54,36) v2(54,34) v2(54,32) v2(54,24) v2(54,22) v2(54,20) v2(54,2) v2(56,64) v2(56,62) v2(56,60) v2(56,36) v2(56,34) v2(56,32) v2(56,24) v2(56,22) v2(56,20) v2(56,12) v2(56,2) v2(58,64) v2(58,62) v2(58,60) v2(58,16) v2(58,2) v2(60,64) v2(60,62) v2(60,60) v2(60,16) v2(60,14) v2(60,8) v2(60,4) v2(60,2) v2(62,64) v2(62,62) v2(62,60) v2(62,16) v2(62,14) v2(62,12) v2(62,10) v2(62,8) v2(62,4) v2(62,2) v2(64,64) v2(64,62) v2(64,60) v2(64,30) v2(64,18) v2(64,16) v2(64,14) v2(64,12) v2(64,10) v2(64,8) v2(64,6) v2(64,4) v2(64,2) v2(66,64) v2(66,62) v2(66,60) v2(66,46) v2(66,44) v2(66,42) v2(66,36) v2(66,32) v2(66,18) v2(66,10) v2(66,8) v2(66,6) v2(66,4) v2(66,2) v2(68,64) v2(68,62) v2(68,60) v2(68,46) v2(68,44) v2(68,42) v2(68,36) v2(68,34) v2(68,32) v2(68,22) v2(68,20) v2(68,18) v2(68,10) v2(68,6) v2(68,4) v2(68,2) v2(70,64) v2(70,62) v2(70,60) v2(70,44) v2(70,42) v2(70,32) v2(70,30) v2(70,18) v2(70,10) v2(70,8) v2(70,6) v2(70,4) v2(70,2) v2(72,64) v2(72,62) v2(72,60) v2(72,10) v2(72,8) v2(72,6) v2(72,4) v2(72,2) v2(74,64) v2(74,62) v2(74,60) v2(74,58) v2(74,10) v2(74,8) v2(74,6) v2(74,4) v2(74,2) v2(76,64) v2(76,62) v2(76,60) v2(76,58) v2(76,56) v2(76,10) v2(76,8) v2(76,6) v2(76,4) v2(76,2) v2(78,64) v2(78,60) v2(78,58) v2(78,56) v2(78,54) v2(78,52) v2(78,50) v2(78,48) v2(78,32) v2(78,30) v2(78,28) v2(78,26) v2(78,24) v2(78,22) v2(78,20) v2(78,18) v2(78,16) v2(78,14) v2(78,12) v2(78,10) v2(78,8) v2(78,6) v2(78,2) v2(80,58) v2(80,56) v2(80,54) v2(80,52) v2(80,50) v2(80,32) v2(80,30) v2(80,26) v2(80,24) v2(80,22) v2(80,20) v2(80,18) v2(80,16) v2(80,14) v2(80,12) v2(80,10) v2(80,8) v2(82,64) v2(82,60) v2(82,58) v2(82,56) v2(82,54) v2(82,52) v2(82,50) v2(82,48) v2(82,32) v2(82,30) v2(82,28) v2(82,26) v2(82,24) v2(82,22) v2(82,20) v2(82,18) v2(82,16) v2(82,14) v2(82,12) v2(82,10) v2(82,8) v2(82,6) v2(82,2)
ADC1_CH0: length 10.7
  Top Layer w0.254: U1.26 H8.4 43.21,56.47 R16.2 43.37,56.64 C11.2 43.32,58.43 R17.1
ADC1_CH1: length 10.6
  Top Layer w0.254: R19.1 43.32,52.48 C12.2 43.37,54.14 R18.2 43.06,53.94 H8.5 U1.27
ADC1_CH2: length 11.7
  Top Layer w0.254: R20.2 5.45,54.77 ; 5.45,54.77 C13.2 ; 5.45,54.77 R21.1 9.27,56.6 H6.8 U1.4
BARRAMENTO_POSITIVO:
  vias: v2(54.66,57.77) v2(56.66,57.77) v2(56.66,55.77) v2(58.66,57.77) v2(58.66,56.77) v2(58.66,55.77) v2(60.66,57.77) v2(60.66,55.77) v2(61.66,56.77) v2(62.66,57.77) v2(62.66,55.77) v2(62.66,53.77) v2(64.66,57.77) v2(64.66,56.77) v2(64.66,55.77) v2(64.66,53.77) v2(64.66,51.77) v2(66.66,57.77) v2(66.66,55.77) v2(66.66,53.77) v2(66.66,51.77) v2(66.66,49.77) v2(66.66,13.77) v2(67.66,53.77) v2(67.66,50.77) v2(67.66,14.77) v2(68.66,57.77) v2(68.66,53.77) v2(68.66,51.77) v2(68.66,49.77) v2(70.66,57.77) v2(70.66,56.77) v2(70.66,55.77) v2(70.66,53.77) v2(70.66,51.77) v2(70.66,50.77) v2(70.66,49.77) v2(70.66,14.77) v2(70.66,13.77) v2(72.66,55.77) v2(72.66,53.77) v2(72.66,51.77) v2(72.66,49.77) v2(72.66,47.77) v2(72.66,45.77) v2(72.66,43.77) v2(72.66,41.77) v2(72.66,39.77) v2(72.66,37.77) v2(72.66,35.77) v2(72.66,33.77) v2(72.66,31.77) v2(72.66,29.77) v2(72.66,27.77) v2(72.66,25.77) v2(72.66,23.77) v2(72.66,21.77) v2(72.66,19.77) v2(72.66,17.77) v2(72.66,15.77) v2(72.66,13.77) v2(73.66,53.77) v2(73.66,50.77) v2(73.66,47.77) v2(73.66,44.77) v2(73.66,41.77) v2(73.66,38.77) v2(73.66,35.77) v2(73.66,32.77) v2(73.66,29.77) v2(73.66,26.77) v2(73.66,23.77) v2(73.66,20.77) v2(73.66,17.77) v2(73.66,14.77) v2(74.66,53.77) v2(74.66,51.77) v2(74.66,49.77) v2(74.66,47.77) v2(74.66,45.77) v2(74.66,43.77) v2(74.66,41.77) v2(74.66,39.77) v2(74.66,37.77) v2(74.66,35.77) v2(74.66,33.77) v2(74.66,31.77) v2(74.66,29.77) v2(74.66,27.77) v2(74.66,25.77) v2(74.66,23.77) v2(74.66,21.77) v2(74.66,19.77) v2(74.66,17.77) v2(74.66,15.77) v2(74.66,13.77) v2(76.66,44.77) v2(76.66,43.77) v2(76.66,41.77) v2(76.66,39.77) v2(76.66,38.77) v2(76.66,37.77) v2(76.66,35.77) v2(76.66,33.77) v2(78.66,43.77) v2(78.66,39.77) v2(78.66,37.77) v2(78.66,33.77) v2(79.66,44.77) v2(79.66,38.77) v2(80.66,43.77) v2(80.66,39.77) v2(80.66,37.77) v2(80.66,33.77) v2(82.66,44.77) v2(82.66,43.77) v2(82.66,41.77) v2(82.66,39.77) v2(82.66,38.77) v2(82.66,37.77) v2(82.66,35.77) v2(82.66,33.77)
CARREGADOR: length 79.7
  Top Layer w0.5: R16.1 46.59,56.62 v1(47.62,55.59)
  Top Layer w1.5: H10.1 47.37,30.19 57.25,30.19 NOREF.1 64.41,33.44 D5.2
  Inner1 w0.5: NOREF.1 50.92,43.01 49.4,43.01 47.62,44.79 v1(47.62,55.59)
  Inner2 w0.5: v1(47.62,55.59) 47.62,44.79 49.4,43.01 50.92,43.01 NOREF.1
  vias: v2(60.17,35.13) v2(60.17,31.13) v2(60.17,29.13) v2(62.17,35.13) v2(62.17,33.13) v2(62.17,31.13) v2(64.17,31.13)
EN_REG_5V: length 4.7
  Top Layer w0.3: U4.8 54.75,9.18 54.85,9.28 55.1,9.28 55.43,9.61 R9.2 R10.1
ESP-5V: length 54.2
  Top Layer w0.254: H7.2 8,13.3 6.86,12.15 6.86,9.61 8.25,8.22 D4.2
  Top Layer w0.3: R13.2 49.92,3.39 L1.2
  Top Layer w1: H7.2 20.32,13.3 28,5.61 C6.1 40.51,5.61 C7.1 43.63,5.48 L1.2
FONTE1: length 32
  Top Layer w0.5: R18.1 49.66,54.19 v1(51.05,52.79) ; R3.2 54.71,49.51 v1(54.48,49.74)
  Top Layer w1.5: D6.2 63.96,45.43 NOREF#6.1 58.09,43.01 55.75,43.01 54.48,41.74 H11.1
  Bottom Layer w0.5: v1(51.05,52.79) 51.18,52.79 51.56,52.41 51.82,52.41 v1(54.48,49.74)
  vias: v2(57.12,47.21) v2(57.12,45.21) v2(57.12,43.21) v2(59.12,45.21) v2(59.12,43.21) v2(59.12,41.21) v2(61.12,43.21) v2(63.12,43.21)
FONTE2: length 100.1
  Top Layer w0.5: R20.1 3.95,50.62 4.7,49.87 4.7,23.84 v1(5.97,22.57)
  Top Layer w1.5: D7.2 64.21,21.8 NOREF#2.1 56.06,17.36 H12.1
  Bottom Layer w0.5: v1(5.97,22.57) 6.35,22.19 43.94,22.19 47.12,25.36 56.94,25.36 NOREF#2.1
  vias: v2(60.23,23.61) v2(60.23,19.61) v2(62.23,23.61) v2(62.23,21.61) v2(62.23,19.61)
IN_REG_5V: length 76.5
  Top Layer w0.3: R9.1 59.31,9.61 60.2,10.5 60.2,12.03 57.54,14.68 C2.1
  Top Layer w1.5: H12.2 48.01,17.36 44.32,21.04 44.32,41.36 H11.2
  Inner1 w1.5: H12.2 48.01,17.36 44.32,21.04 44.32,41.36 H11.2
  vias: v2(50.16,11.26) v2(51.05,11.77) v2(51.28,16.12) v2(51.28,14.12)
PH5V: length 14.8
  Top Layer w0.3: v1(57.66,12.66) 58.49,11.83 C5.1 ; v1(48.77,11.14) 46.86,11.14 45.72,9.99
  Bottom Layer w0.3: v1(57.66,12.66) 50.29,12.66 v1(48.77,11.14)
  vias: v1(43.4,11.05) v1(43.52,7.8) v1(47.6,7.8) v1(49.85,9.65)
PORTA0: length 47.3
  Top Layer w0.254: v1(29.46,39.97) 27.43,39.97 U1.5 H6.7 ; Q2.1 50.11,38.81 R2.2 48.25,38.95 v1(47.5,38.95)
  Bottom Layer w0.254: v1(47.5,38.95) 46.48,39.97 v1(29.46,39.97)
PORTA1: length 38.1
  Top Layer w0.254: Q4.1 46.47,49.1 R4.2 v1(43.31,49.1) ; H6.6 U1.6
  Bottom Layer w0.254: U1.6 14.73,50.12 42.28,50.12 v1(43.31,49.1)
PORTA2: length 52.3
  Top Layer w0.254: v1(46.99,27.65) 47.62,27.65 R6.2 49.48,27.38 Q6.1 ; v1(30.35,27.27) 28.7,28.92 28.7,33.61 13.46,48.86 9.4,48.86
  Bottom Layer w0.254: v1(46.99,27.65) 46.61,27.27 v1(30.35,27.27)
PORTA3: length 47.7
  Top Layer w0.254: H7.11 U1.12 ; R22.1 55.13,40.09 v1(52.58,40.09)
  Bottom Layer w0.254: v1(52.58,40.09) 49.91,37.42 34.16,37.42 32.89,36.16 U1.12
PORTA4: length 47.6
  Top Layer w0.254: U1.13 H7.10
  Top Layer w0.3: v1(52.07,28.53) 52.58,28.03 R23.1
  Bottom Layer w0.3: U1.13 13.72,33.87 21.46,33.87 25.53,29.81 41.91,29.81 43.18,28.53 v1(52.07,28.53)
VSENSE_REG_5V: length 4.7
  Top Layer w0.3: U4.6 54.2,5.76 R14.2 R15.1
$1N643: length 12
  Top Layer w0.254: Q2.3 v1(53.72,38.06) ; Q1.1 62.43,39.71 v1(61.59,39.71)
  Bottom Layer w0.254: v1(53.72,38.06) 57.4,38.06 57.91,38.57 60.45,38.57 v1(61.59,39.71)
$1N952:
  vias: v1(59.69,51.52) v1(59.72,48.74) v1(62.1,51.52) v1(62.1,48.73)
$1N954: length 10.7
  Top Layer w0.254: Q3.1 57.79,51.02 R3.1 56.19,50.89 51.21,50.89 Q4.3
$1N1160:
  vias: v2(65.41,28.92) v2(66.29,25.11) v2(66.77,28.22)
$1N1162: length 12.1
  Top Layer w0.254: Q6.3 51.8,26.5 61.1,26.5 R5.1 61.79,27.2 Q5.1
$1N1257: length 1.3
  Top Layer w0.3: R22.2 56.92,39.87 U2.1
$1N1849: length 1.7
  Top Layer w0.3: U4.10 54.36,10.34 R11.1
$1N1919: length 3.5
  Top Layer w0.3: C5.2 56.51,11.26 54.93,9.68 U4.9
$1N2046: length 5.6
  Top Layer w0.3: U4.7 54.68,8.68 56.92,6.44 R24.2 57.21,6.38 C3.1
$1N2413: length 1.8
  Top Layer w0.3: R14.1 53.6,3.9 R13.1
$1N6328: length 1.7
  Top Layer w0.5: U3.1 57.35,28.03 R23.2
$1N9020: length 4.1
  Top Layer w0.254: H6.11 U1.1
$1N9023: length 4.1
  Top Layer w0.254: 13.46,61.56 9.4,61.56
$1N9026: length 4.1
  Top Layer w0.254: H6.9 13.46,59.02
$1N9087: length 4.1
  Top Layer w0.254: H6.4 U1.8
$1N9090: length 4.1
  Top Layer w0.254: 13.46,43.78 9.4,43.78
$1N9093: length 4.1
  Top Layer w0.254: H6.2 U1.10
$1N9096: length 4.1
  Top Layer w0.254: U1.11 H6.1
$1N9099: length 4.1
  Top Layer w0.254: H7.9 13.46,31.08
$1N9102: length 4.1
  Top Layer w0.254: U1.15 H7.8
$1N9105: length 4.1
  Top Layer w0.254: H7.7 13.46,26
$1N9108: length 4.1
  Top Layer w0.254: U1.17 H7.6
$1N9111: length 4.1
  Top Layer w0.254: 9.4,20.92 13.46,20.92
$1N9114: length 4.1
  Top Layer w0.254: U1.19 H7.4
$1N9117: length 4.1
  Top Layer w0.254: H7.3 U1.20
$1N9288: length 4.1
  Top Layer w0.254: 40.39,61.56 36.32,61.56
$1N9291: length 4.1
  Top Layer w0.254: 36.32,59.02 H8.3
$1N9294: length 4.1
  Top Layer w0.254: H8.6 U1.28
$1N9307: length 4.1
  Top Layer w0.254: 36.32,48.86 40.39,48.86
$1N9310: length 4.1
  Top Layer w0.254: U1.30 H8.8
$1N9313: length 4.1
  Top Layer w0.254: 36.32,43.78 40.39,43.78
$1N9316: length 4.1
  Top Layer w0.254: H8.10 U1.32
$1N9319: length 4.1
  Top Layer w0.254: H8.11 U1.33
$1N9322: length 4.1
  Top Layer w0.254: U1.34 H9.1
$1N9325: length 4.1
  Top Layer w0.254: H9.2 U1.35
$1N9328: length 4.1
  Top Layer w0.254: 36.32,31.08 H9.3
$1N9331: length 4.1
  Top Layer w0.254: U1.37 H9.4
$1N9334: length 4.1
  Top Layer w0.254: H9.5 36.32,26
$1N9337: length 4.1
  Top Layer w0.254: U1.39 H9.6
$1N9340: length 4.1
  Top Layer w0.254: 40.39,20.92 36.32,20.92
$1N9343: length 4.1
  Top Layer w0.254: U1.41 H9.8
$1N9346: length 4.1
  Top Layer w0.254: H9.9 U1.42
$1N9442: length 3.2
  Top Layer w0.3: C4.1 58.73,6.38 R24.1

## Copper pours and planes (outline as drawn; the poured copper is in the pictures)
GND on Top Layer: 0,66 84,66 84,0 0,0
GND on Bottom Layer: 0,66 84,66 84,0 0,0
GND on Inner1: 0,66 84,66 84,0 0,0
GND on Inner2: 0,66 84,66 84,0 0,0
BARRAMENTO_POSITIVO on Top Layer: 70.49,58.89 52.91,58.89 52.66,58.63 52.66,53.55 61.85,53.55 63.5,51.9 63.5,48.47 71.37,48.47 71.37,40.09 68.45,40.09 68.45,36.54 71.63,36.54 71.63,27.9 69.09,27.9 69.09,24.6 71.39,24.6 71.39,15.67 65.28,15.67 65.28,11.77 76.2,11.77 76.2,32.73 83.57,32.73 83.57,45.55 76.07,45.55 76.07,53.3
BARRAMENTO_POSITIVO on Bottom Layer: 70.49,58.89 52.91,58.89 52.66,58.63 52.66,53.55 61.85,53.55 63.5,51.9 63.5,48.47 71.37,48.47 71.37,40.09 68.45,40.09 68.45,36.54 71.63,36.54 71.63,27.9 69.09,27.9 69.09,24.6 71.39,24.6 71.39,15.67 65.28,15.67 65.28,11.77 76.2,11.77 76.2,32.73 83.57,32.73 83.57,45.55 76.07,45.55 76.07,53.3
BARRAMENTO_POSITIVO on Bottom Layer: 70.44,58.82 52.87,58.82 52.62,58.57 52.62,53.49 61.81,53.49 63.46,51.84 63.46,48.41 71.33,48.41 71.33,40.03 68.41,40.03 68.41,36.47 71.59,36.47 71.59,27.84 69.05,27.84 69.05,24.53 71.35,24.53 71.35,15.6 65.24,15.6 65.24,11.71 76.16,11.71 76.16,32.66 83.52,32.66 83.52,45.49 76.03,45.49 76.03,53.24
BARRAMENTO_POSITIVO on Inner1: 70.49,58.89 52.91,58.89 52.66,58.63 52.66,53.55 61.85,53.55 63.5,51.9 63.5,48.47 71.37,48.47 71.37,40.09 68.45,40.09 68.45,36.54 71.63,36.54 71.63,27.9 69.09,27.9 69.09,24.6 71.39,24.6 71.39,15.67 65.28,15.67 65.28,11.77 76.2,11.77 76.2,32.73 83.57,32.73 83.57,45.55 76.07,45.55 76.07,53.3
BARRAMENTO_POSITIVO on Inner2: 70.49,58.89 52.91,58.89 52.66,58.63 52.66,53.55 61.85,53.55 63.5,51.9 63.5,48.47 71.37,48.47 71.37,40.09 68.45,40.09 68.45,36.54 71.63,36.54 71.63,27.9 69.09,27.9 69.09,24.6 71.39,24.6 71.39,15.67 65.28,15.67 65.28,11.77 76.2,11.77 76.2,32.73 83.57,32.73 83.57,45.55 76.07,45.55 76.07,53.3
CARREGADOR on Top Layer: 58.86,38.01 58.86,36.09 58.93,36.03 58.17,35.27 58.17,27.44 60.01,27.44 60.07,27.51 60.07,28.41 62.36,30.69 66.04,30.69 66.04,36.16 65.79,36.41 64.14,36.41 63.88,36.67 63.88,37.68 60.58,37.68 60.58,38.02 58.87,38.02
CARREGADOR on Bottom Layer: 58.86,38.01 58.86,36.09 58.93,36.03 58.17,35.27 58.17,27.19 58.23,27.13 59.69,27.13 60.07,27.51 60.07,28.41 62.36,30.69 66.04,30.69 66.04,36.16 65.79,36.41 64.52,36.41 63.88,37.05 63.88,37.68 60.58,37.68 60.58,38.02 58.87,38.02
CARREGADOR on Inner1: 58.86,38.01 58.86,36.09 58.93,36.03 58.17,35.27 58.17,27.19 58.23,27.13 59.69,27.13 60.07,27.51 60.07,28.41 62.36,30.69 66.04,30.69 66.04,36.16 65.79,36.41 64.52,36.41 63.88,37.05 63.88,37.68 60.58,37.68 60.58,38.02 58.87,38.02
CARREGADOR on Inner2: 58.86,38.01 58.86,36.09 58.93,36.03 58.17,35.27 58.17,27.19 58.23,27.13 59.69,27.13 60.07,27.51 60.07,28.41 62.36,30.69 66.04,30.69 66.04,36.16 65.79,36.41 64.52,36.41 63.88,37.05 63.88,37.68 60.58,37.68 60.58,38.02 58.87,38.02
FONTE1 on Top Layer: 55.12,50 58.67,50 58.67,47.58 65.28,47.58 65.28,42.63 62.61,42.63 60.58,40.6 60.58,39.47 60.32,39.21 58.87,39.21 58.86,39.22 58.86,40.84 58.21,41.49 55.12,41.49
FONTE1 on Bottom Layer: 64.64,39.58 67.69,39.58 67.69,36.79 64.64,36.79
FONTE1 on Bottom Layer: 55.12,50 58.67,50 58.67,47.58 65.28,47.58 65.28,42.63 62.61,42.63 60.58,40.6 60.58,39.47 60.32,39.21 58.87,39.21 58.86,39.22 58.86,40.84 58.21,41.49 55.12,41.49
FONTE1 on Inner1: 55.12,50 58.67,50 58.67,47.58 65.28,47.58 65.28,42.63 62.61,42.63 60.58,40.6 60.58,39.47 60.32,39.21 58.87,39.21 58.86,39.22 58.86,40.84 58.21,41.49 55.12,41.49
FONTE1 on Inner1: 64.64,39.58 67.69,39.58 67.69,36.79 64.64,36.79
FONTE1 on Inner2: 55.12,50 58.67,50 58.67,47.58 65.28,47.58 65.28,42.63 62.61,42.63 60.58,40.6 60.58,39.47 60.32,39.21 58.87,39.21 58.86,39.22 58.86,40.84 58.21,41.49 55.12,41.49
FONTE1 on Inner2: 64.64,39.58 67.69,39.58 67.69,36.79 64.64,36.79
FONTE2 on Top Layer: 58.23,25.96 62.39,25.96 62.74,25.61 64.37,25.61 64.39,25.6 64.39,23.96 65.53,22.82 65.66,22.82 65.66,19.64 63.25,19.64 61.21,17.61 58.29,17.61 58.23,17.68
FONTE2 on Bottom Layer: 58.23,25.96 62.39,25.96 62.74,25.61 64.37,25.61 64.39,25.6 64.39,23.96 65.53,22.82 65.66,22.82 65.66,19.64 63.25,19.64 61.21,17.61 58.29,17.61 58.23,17.68
FONTE2 on Inner1: 58.23,25.96 62.39,25.96 62.74,25.61 64.37,25.61 64.39,25.6 64.39,23.96 65.53,22.82 65.66,22.82 65.66,19.64 63.25,19.64 61.21,17.61 58.29,17.61 58.23,17.68
FONTE2 on Inner2: 58.23,25.96 62.39,25.96 62.74,25.61 64.37,25.61 64.39,25.6 64.39,23.96 65.53,22.82 65.66,22.82 65.66,19.64 63.25,19.64 61.21,17.61 58.29,17.61 58.23,17.68
IN_REG_5V on Top Layer: 51.59,10.12 50.67,10.12 49.66,11.14 49.66,11.86 49.32,12.2 49.32,13.38 49.28,13.42 49.28,18.11 49.29,18.12 53.59,18.12 53.59,14.95 53.09,14.44 53.09,13.17 51.56,11.64 51.56,10.15
IN_REG_5V on Inner1: 51.59,10.12 50.39,10.12 50.39,10.15 49.66,10.88 49.66,11.86 49.32,12.2 49.32,13.38 49.28,13.42 49.28,18.11 49.29,18.12 53.59,18.12 53.59,14.95 53.09,14.44 53.09,13.17 51.56,11.64 51.56,10.15
IN_REG_5V on Inner2: 51.59,10.12 50.39,10.12 50.39,10.15 49.66,10.88 49.66,11.86 49.32,12.2 49.32,13.38 49.28,13.42 49.28,18.11 49.29,18.12 53.59,18.12 53.59,14.95 53.09,14.44 53.09,13.17 51.56,11.64 51.56,10.15
PH5V on Top Layer: 43,11.5 51.6,11.5 51.6,7 43,7
PH5V on Bottom Layer: 43,11.5 51.6,11.5 51.6,7 43,7
PH5V on Inner1: 43,11.5 51.6,11.5 51.6,7 43,7
PH5V on Inner2: 43,11.5 51.6,11.5 51.6,7 43,7
$1N629 on Top Layer: 64.39,41.23 67.69,41.23 67.69,36.92 64.39,36.92
$1N643 on Top Layer: 61.06,40.09 63.88,40.09 63.88,38.36 61.06,38.36
$1N952 on Top Layer: 59.31,52.03 62.61,52.03 62.61,48.35 59.31,48.35
$1N952 on Bottom Layer: 59.31,52.03 62.61,52.03 62.61,48.35 59.31,48.35
$1N952 on Inner1: 59.31,52.03 62.61,52.03 62.61,48.35 59.31,48.35
$1N952 on Inner2: 59.31,52.03 62.61,52.03 62.61,48.35 59.31,48.35
$1N1160 on Top Layer: 64.77,29.55 68.2,29.55 68.2,24.22 65.66,24.22 64.77,25.11
$1N1160 on Bottom Layer: 64.77,29.55 68.2,29.55 68.2,24.22 65.66,24.22 64.77,25.11
$1N1160 on Inner1: 64.77,29.55 68.2,29.55 68.2,24.22 65.66,24.22 64.77,25.11
$1N1160 on Inner2: 64.77,29.55 68.2,29.55 68.2,24.22 65.66,24.22 64.77,25.11

## Text on the board
Bottom Silkscreen Layer: +VCC-OUT | GND | VCC_F1 | VCC_F2 | VCC_C | FONTE_1 | FONTE_2 | CARREGADOR | github.com/Dev-Murilo
Top Silkscreen Layer: +VCC-OUT | GND | VCC_F1 | VCC_F2 | VCC_C
